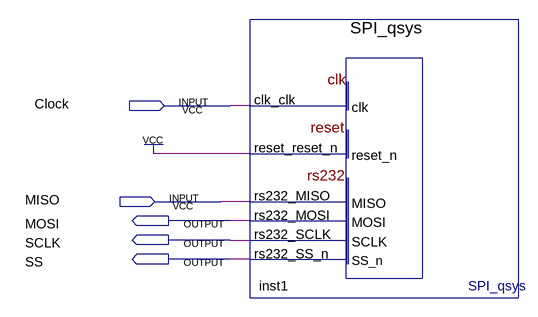
[diagram p0: schematic sheet]
// Quartus schematic Nios_SPI.bdf as structural Verilog: 1 symbols, 5 pins
module Nios_SPI (
  input  Clock,
  input  MISO,
  output MOSI,
  output SCLK,
  output SS
);

  SPI_qsys inst1 (
    .clk_clk(Clock), .reset_reset_n(1'b1), .rs232_MISO(MISO), .rs232_MOSI(MOSI), .rs232_SCLK(SCLK),
    .rs232_SS_n(SS));
endmodule
